# Altium project placa_adquisicion_ecg.PrjPcb
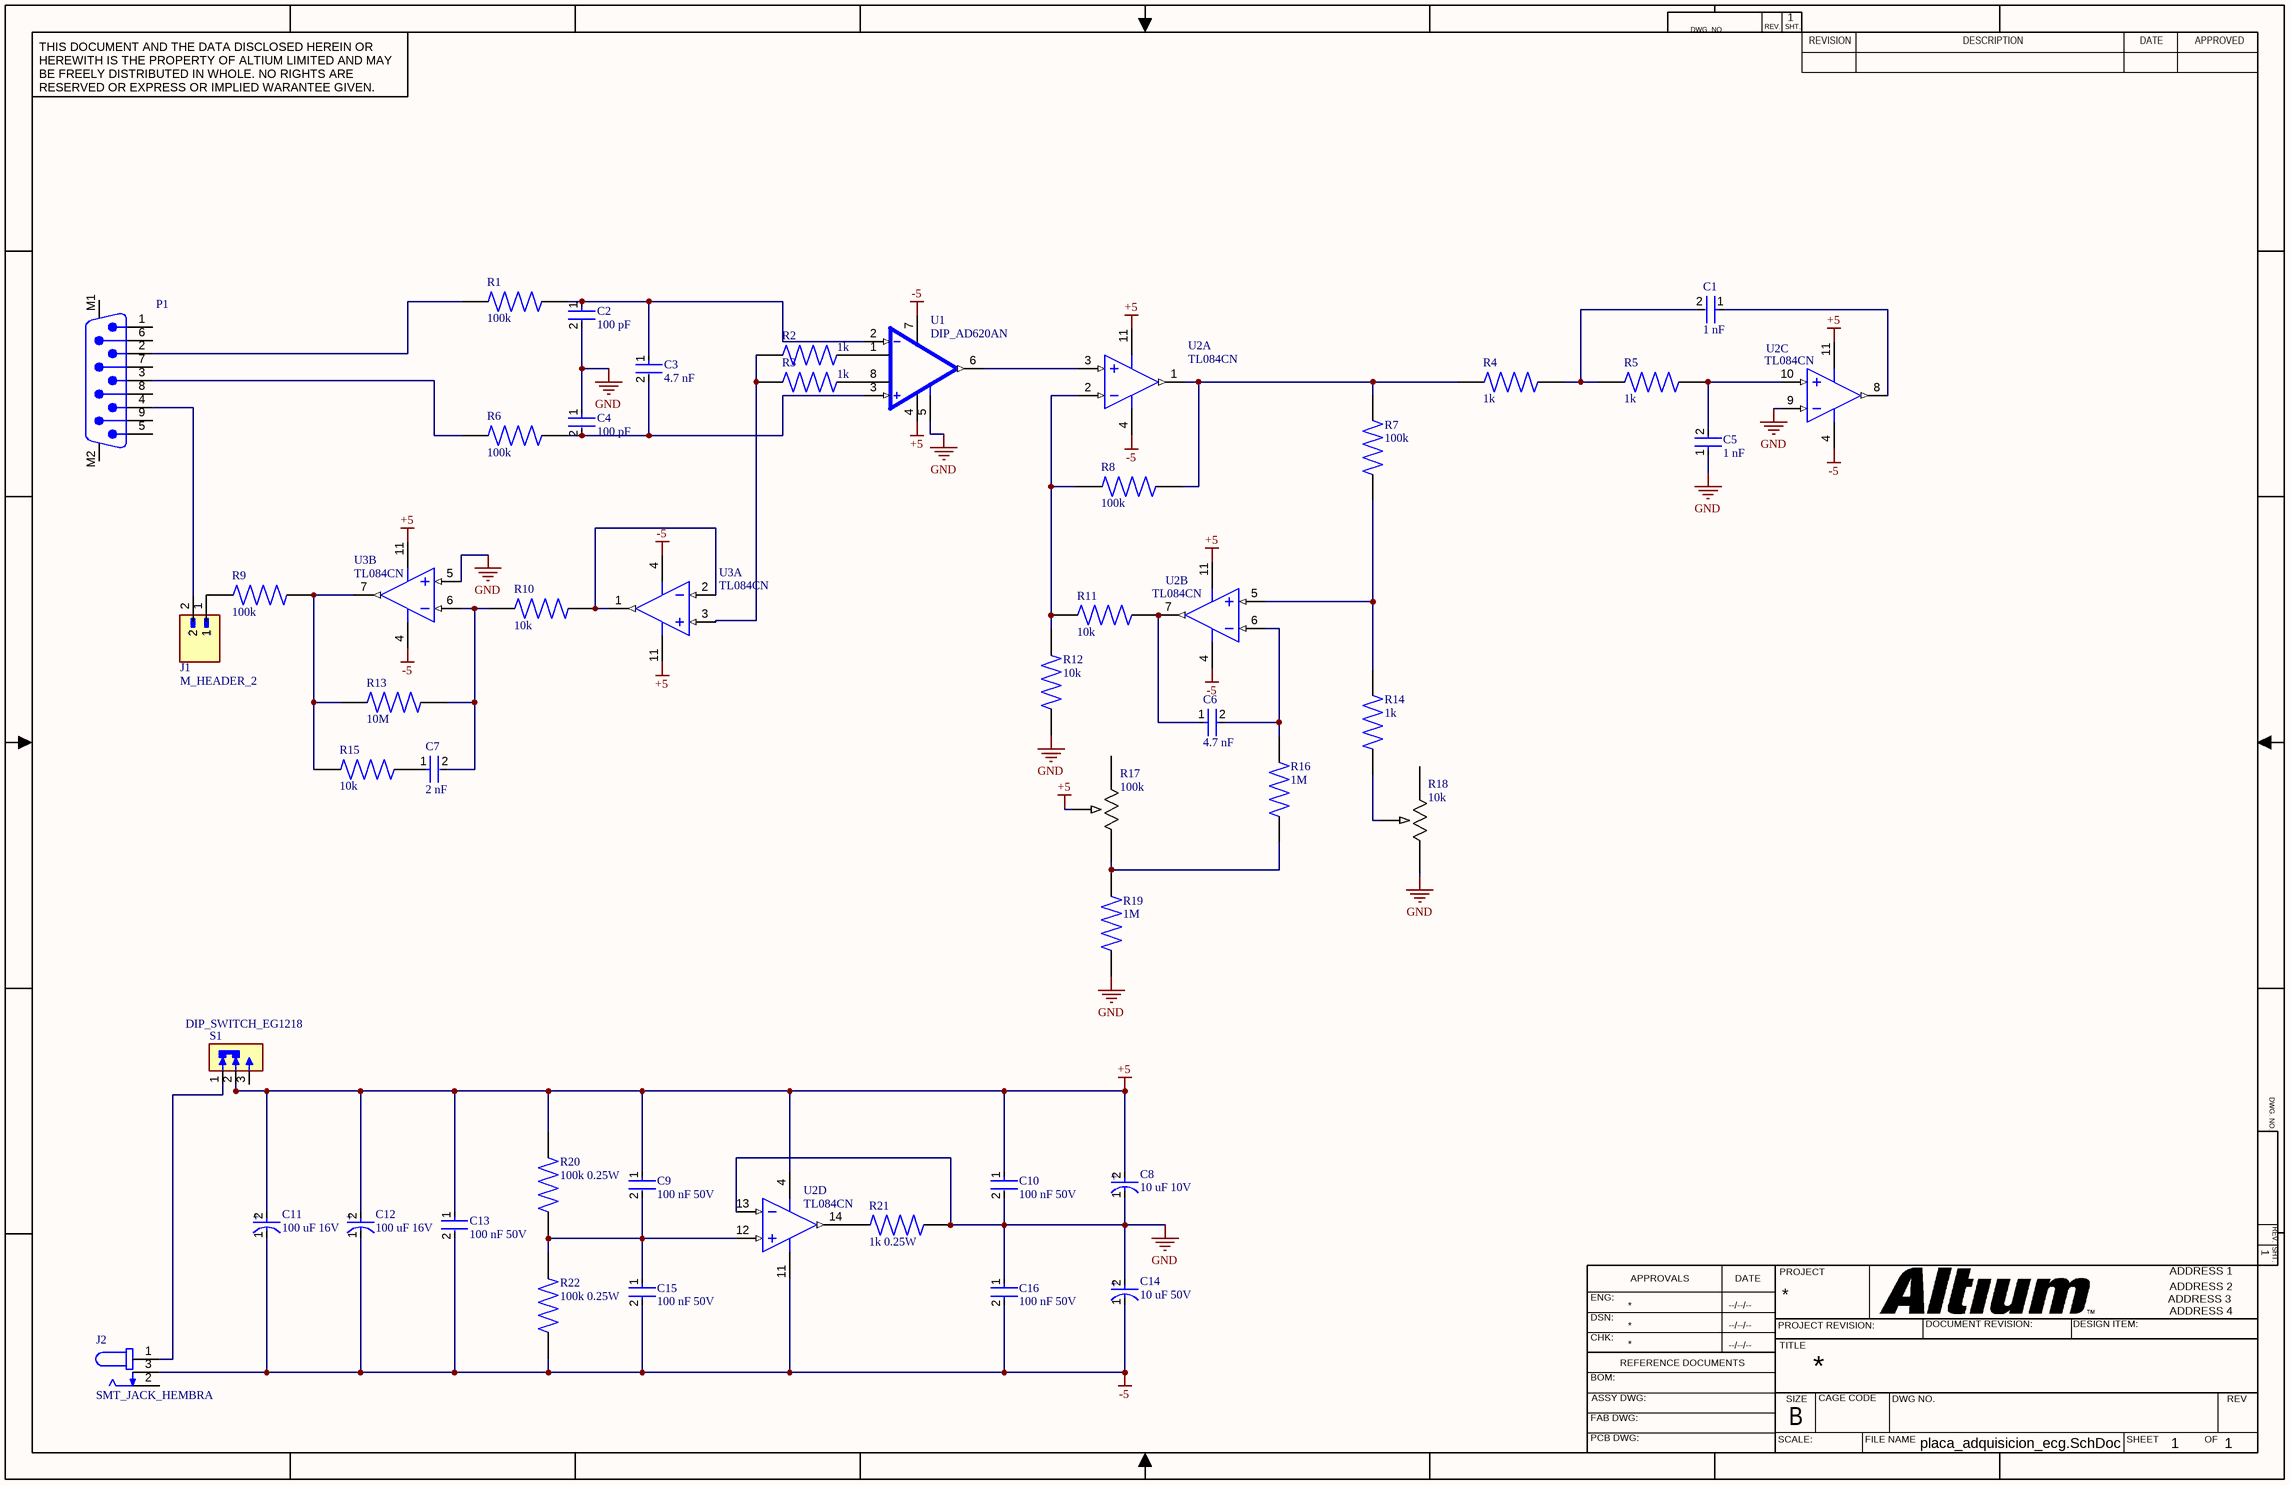
[diagram p0: placa_adquisicion_ecg.SchDoc]
1 sheet, 45 parts. Net scope: global (net labels, ports and power ports of the same name join across sheets).
Board file: placa_adquisicion_ecg.PcbDoc

## Sheet placa_adquisicion_ecg.SchDoc
size 431 x 279 mm; Organization: ORGANIZATION; Address1: ADDRESS 1; Address2: ADDRESS 2; Address3: ADDRESS 3; Address4: ADDRESS 4; Revision: -; SheetNumber: 1; SheetTotal: 1; ENG_APP_DATE: --/--/--; DSN_APP_DATE: --/--/--; CHK_APP_DATE: --/--/--

### Parts
C1  1 nF  [C_1206_50V]
C2  100 pF  [C_1206_50V]
C3  4.7 nF  [C_1206_50V]
C4  100 pF  [C_1206_50V]
C5  1 nF  [C_1206_50V]
C6  4.7 nF  [C_1206_50V]
C7  2 nF  [C_1206_50V]
C8  10 uF 10V  [C_DIP_100uF_16V]
C9  100 nF 50V  [C_1206_50V]
C10  100 nF 50V  [C_1206_50V]
C11  100 uF 16V  [C_DIP_100uF_16V]
C12  100 uF 16V  [C_DIP_100uF_16V]
C13  100 nF 50V  [C_1206_50V]
C14  10 uF 50V  [C_DIP_100uF_16V]
C15  100 nF 50V  [C_1206_50V]
C16  100 nF 50V  [C_1206_50V]
J1  M_HEADER_2  [M_HEADER_2]
J2  SMT_JACK_HEMBRA  [SMT_JACK_HEMBRA]
P1  618009231221  [DIP_DB9M_90DEG]  (value not drawn)
R1  100k  [R_1206_0.25W]
R2  1k  [R_1206_0.25W]
R3  1k  [R_1206_0.25W]
R4  1k  [R_1206_0.25W]
R5  1k  [R_1206_0.25W]
R6  100k  [R_1206_0.25W]
R7  100k  [R_1206_0.25W]
R8  100k  [R_1206_0.25W]
R9  100k  [R_1206_0.25W]
R10  10k  [R_1206_0.25W]
R11  10k  [R_1206_0.25W]
R12  10k  [R_1206_0.25W]
R13  10M  [R_1206_0.25W]
R14  1k  [R_1206_0.25W]
R15  10k  [R_1206_0.25W]
R16  1M  [R_1206_0.25W]
R17  100k  [POT_TRIMMER]
R18  10k  [POT_TRIMMER]
R19  1M  [R_1206_0.25W]
R20  100k 0.25W  [R_1206_0.25W]
R21  1k 0.25W  [R_1206_0.25W]
R22  100k 0.25W  [R_1206_0.25W]
S1  DIP_SWITCH_EG1218  [DIP_SWITCH_EG128]
U1  DIP_AD620AN  [DIP_AD620AN]
U2  TL084CN  [DIP_TL084CN]  (parts A,B,C,D of 4)
U3  TL084CN  [DIP_TL084CN]  (parts A,B of 4)

### Nets
+5: C8.2(A) C9.1 C10.1 C11.2(A) C12.2(A) C13.1 R17.2 R20.2 S1.2(COM) U1.4(-VS) U2.4(VCC+) U2.11(VCC-) U3.11(VCC-)
-5: C11.1(C) C12.1(C) C13.2 C14.1(C) C15.2 C16.2 J2.3 R22.1 U1.7(+VS) U2.4(VCC+) U2.11(VCC-) U3.4(VCC+)
GND: C2.2 C4.1 C5.1 C8.1(C) C10.2 C14.2(A) C16.1 R12.1 R18.1 R19.1 R21.2 U1.5(REF) U2.9(IN3-) U2.13(IN4-) U3.5(IN2+)
NetC1_1: C1.1 U2.8(OUT3)
NetC1_2: C1.2 R4.2 R5.1
NetC2_1: C2.1 C3.1 R1.2 U1.2(-IN)
NetC3_2: C3.2 C4.2 R6.2 U1.3(+IN)
NetC5_2: C5.2 R5.2 U2.10(IN3+)
NetC6_1: C6.1 R11.2 U2.7(OUT2)
NetC6_2: C6.2 R16.2 U2.6(IN2-)
NetC7_1: C7.1 R15.2
NetC7_2: C7.2 R10.1 R13.2 U3.6(IN2-)
NetC9_2: C9.2 C15.1 R20.1 R22.2 U2.12(IN4+)
NetJ1_1: J1.1 R9.1
NetJ1_2: J1.2 P1.4
NetJ2_1: J2.1 S1.1(NC)
NetP1_2: P1.2 R1.1
NetP1_3: P1.3 R6.1
NetR2_1: R2.1 R3.1 U3.3(IN1+)
NetR2_2: R2.2 U1.1(RG_1)
NetR3_2: R3.2 U1.8(RG_8)
NetR4_1: R4.1 R7.2 R8.2 U2.1(OUT1)
NetR7_1: R7.1 R14.2 U2.5(IN2+)
NetR8_1: R8.1 R11.1 R12.2 U2.2(IN1-)
NetR9_2: R9.2 R13.1 R15.1 U3.7(OUT2)
NetR10_2: R10.2 U3.1(OUT1) U3.2(IN1-)
NetR14_1: R14.1 R18.2
NetR16_1: R16.1 R17.1 R19.2
NetR21_1: R21.1 U2.14(OUT4)
NetU1_6: U1.6(OUTPUT) U2.3(IN1+)

Not connected (* = marked no-connect by the designer): J2 2; P1 1 5 6 7 8 9 M1 M2; R17 3; R18 3; S1 3(NO)

### Notes on the sheet
- DWG. NO.
- REV.
- SHT.
- THIS DOCUMENT AND THE DATA DISCLOSED HEREIN OR HEREWITH IS THE PROPERTY OF ALTIUM LIMITED AND MAY BE FREELY DISTRIBUTED IN WHOLE. NO RIGHTS ARE RESERVED OR EXPRESS OR IMPLIED WARANTEE GIVEN.
- REVISION
- DESCRIPTION
- DATE
- APPROVED
- ENG:
- APPROVALS
- PROJECT
- DSN:
- CHK:
- REFERENCE DOCUMENTS
- PROJECT REVISION:
- TITLE
- DOCUMENT REVISION:
- DESIGN ITEM:
- BOM:
- FAB DWG:
- PCB DWG:
- ASSY DWG:
- SCALE:
- SIZE
- B
- CAGE CODE
- FILE NAME
- DWG NO.
- SHEET
- OF
- REV
- (in symbol C_DIP_100uF_16V) +

### Library data of the parts
C1 C3 C5-C7 = C_1206_50V: Multilayer Ceramic Capacitor, C Series, 100 Pf, - 5%, C0g / Np0, 50 V, 1206 [3216 Metric]; Manufacturer Part Number: C1206C101J5GACTU; Manufacturer: KEMET; Capacitance: 100 pF; Automotive Grade: Grade 0; Temperature Coefficient: 15%; Tolerance: 0.05; Voltage Rating: 50 V; Value: 100 pF; Octopart: https://octopart.com/c1206c101j5gactu-kemet-102340; Category: Cap; Device Class L2: Capacitors; Temperature: -55°C to +150°C; Material: Ceramic; ComponentLink2Description: Datasheet; Temperature Range High: +150°C; ComponentLink2URL: https://content.kemet.com/datasheets/KEM_C1007_X8R_ULTRA_150C_SMD.pdf; Ipc Land Pattern Name: CAPC320160X78; Device Class L3: Ceramic Capacitors; Package: C1206C-EB; Lead Free: Yes; Height: 0.88mm; Digikey Description: Multilayer Ceramic Capacitor, C Series, 100 Pf, - 5%, C0g / Np0, 50 V, 1206 [3216 Metric]; Device Class L1: Passive Components; Automotive: Yes; RoHS: TRUE; Temperature Range Low: -55°C; Temperature Characteristic: C0G; Mouser Description: Multilayer Ceramic Capacitors MLCC - SMD/SMT 50volts 100pF C0G 5%
C2 C4 = C_1206_50V: Multilayer Ceramic Capacitor, C Series, 100 Pf, - 5%, C0g / Np0, 50 V, 1206 [3216 Metric]; Manufacturer Part Number: C1206C101J5GACTU; Manufacturer: KEMET; Automotive Grade: Grade 0; Temperature Coefficient: 15%; Tolerance: 0.05; Voltage Rating: 50 V; Capacitance: 100 pF; Octopart: https://octopart.com/c1206c101j5gactu-kemet-102340; Category: Cap; Device Class L2: Capacitors; Temperature: -55°C to +150°C; Material: Ceramic; ComponentLink2Description: Datasheet; Temperature Range High: +150°C; ComponentLink2URL: https://content.kemet.com/datasheets/KEM_C1007_X8R_ULTRA_150C_SMD.pdf; Ipc Land Pattern Name: CAPC320160X78; Device Class L3: Ceramic Capacitors; Package: C1206C-EB; Lead Free: Yes; Height: 0.88mm; Digikey Description: Multilayer Ceramic Capacitor, C Series, 100 Pf, - 5%, C0g / Np0, 50 V, 1206 [3216 Metric]; Device Class L1: Passive Components; Automotive: Yes; RoHS: TRUE; Temperature Range Low: -55°C; Temperature Characteristic: C0G; Mouser Description: Multilayer Ceramic Capacitors MLCC - SMD/SMT 50volts 100pF C0G 5%; Value: 100 pF
C8 C11 C12 C14 = C_DIP_100uF_16V: Aluminum Electrolytic Capacitors (Radial Lead Type) AEC-Q200 Qualified 100uF ±20% 16V; Lead/Base Style: Straight; Life (Hours): 1000Hour; Polarity: Polar; Ripple Current: 110mA; Lead Diameter: 0.5mm; Packaging: Bulk; Tolerance: 20%; Package Quantity: 200; Lead Pitch: 2.5mm; RoHS Compliant: Yes; Length: 11mm; Capacitance: 100uF; Max Operating Temperature: 105°C; REACH SVHC: No SVHC; Termination: Radial; Lead Free: Lead Free; Number of Pins: 2; Ripple Current (AC): 110mA; Mount: Through Hole; Diameter: 5mm; Min Operating Temperature: -55°C; Construction: RADIAL; Voltage Rating: 16V; Voltage Rating (DC): 16V; Case/Package: Radial; Height: 11mm; Height - Seated (Max): 0.492inch; Voltage: 16V; Series: HD
C9 C10 C13 C15 C16 = C_1206_50V: Multilayer Ceramic Capacitor, C Series, 100 Pf, - 5%, C0g / Np0, 50 V, 1206 [3216 Metric]; Manufacturer Part Number: C1206C101J5GACTU; Manufacturer: KEMET; Capacitance: 100 pF; Automotive Grade: Grade 0; Temperature Coefficient: 15%; Tolerance: 0.05; Value: 100 pF; Octopart: https://octopart.com/c1206c101j5gactu-kemet-102340; Category: Cap; Device Class L2: Capacitors; Temperature: -55°C to +150°C; Material: Ceramic; ComponentLink2Description: Datasheet; Temperature Range High: +150°C; ComponentLink2URL: https://content.kemet.com/datasheets/KEM_C1007_X8R_ULTRA_150C_SMD.pdf; Ipc Land Pattern Name: CAPC320160X78; Device Class L3: Ceramic Capacitors; Package: C1206C-EB; Lead Free: Yes; Height: 0.88mm; Digikey Description: Multilayer Ceramic Capacitor, C Series, 100 Pf, - 5%, C0g / Np0, 50 V, 1206 [3216 Metric]; Device Class L1: Passive Components; Automotive: Yes; RoHS: TRUE; Temperature Range Low: -55°C; Temperature Characteristic: C0G; Voltage Rating: 50 V; Mouser Description: Multilayer Ceramic Capacitors MLCC - SMD/SMT 50volts 100pF C0G 5%
J1 = M_HEADER_2: 2.54mm (0.1) Pitch SIL Vertical Throughboard Pin Header, 6.1mm mating pin height, tin, 2 contacts; MF: Harwin; MP: M20-9990246; SnapEDA_Link: https://www.snapeda.com/parts/M20-9990246/Harwin/view-part/?ref=snap; Package: None; Value: *; Check_prices: https://www.snapeda.com/parts/M20-9990246/Harwin/view-part/?ref=eda
J2 = SMT_JACK_HEMBRA: 2.0 x 6.3 mm, 5.0 A, Horizontal, Surface Mount (SMT), Dc Power Jack Connector; MF: Same Sky; MP: PJ-036AH-SMT-TR; SnapEDA_Link: https://www.snapeda.com/parts/PJ-036AH-SMT-TR/Same+Sky/view-part/?ref=snap; Package: None; Value: *; Check_prices: https://www.snapeda.com/parts/PJ-036AH-SMT-TR/Same+Sky/view-part/?ref=eda
P1 = DIP_DB9M_90DEG: NexarPartId: 22865742; Pitch: 2.77mm; Number of Contacts: 9; Operating Supply Voltage: 125V; Insulation Resistance: 5GΩ; Gender: Male; Contact Resistance: 30mΩ; Current Rating: 3A; Mount: Through Hole; Housing Material: Steel; Contact Plating: Gold; Width: 12.5mm; Insulation Material: PBT; RoHS: Compliant; Depth: 18.5mm; Contact Material: Gold; Max Operating Temperature: 105°C; Min Operating Temperature: -55°C; Termination: SMD/SMT; Height: 12.7mm; Voltage Rating: 125V; Length: 30.8mm; Orientation: Right Angle; Number of Rows: 2; Number of Pins: 9; REACH SVHC: Unknown
R1-R16 R19-R22 = R_1206_0.25W: 10 kOhms Â±1% 0.25W, 1/4W Chip Resistor 1206 (3216 Metric) Moisture Resistant Thick Film; MF: Yageo; MP: RC1206FR-0710KL; Package: 3116 Yageo; Price: None; Check_prices: https://www.snapeda.com/parts/RC1206FR-0710KL/Yageo/view-part/?ref=eda; Value: *; SnapEDA_Link: https://www.snapeda.com/parts/RC1206FR-0710KL/Yageo/view-part/?ref=snap; Availability: In Stock; Purchase-URL: https://pricing.snapeda.com/search?q=RC1206FR-0710KL&ref=eda
R17 R18 = POT_TRIMMER: Description; Manufacturer_Name: Bourns Electronics; Manufacturer_Part_Number: PV36W104C01B00; Type: Trimmer Potentiometers; Copyright: Copyright (C) 2025 Ultra Librarian. All rights reserved.
S1 = DIP_SWITCH_EG128: Slide Switch, EG Series, SPDT, Non-Shorting, ON-ON, 200mA DC, 30VDC, PC Pin | E-Switch EG1218; SnapEDA_Link: https://www.snapeda.com/parts/EG1218/E-Switch/view-part/?ref=snap; Package: None; Value: *; MF: E-Switch; MP: EG1218; Check_prices: https://www.snapeda.com/parts/EG1218/E-Switch/view-part/?ref=eda
U1 = DIP_AD620AN: Instrumentation Amplifier 1 Circuit - 8-PDIP; MF: Analog Devices; Value: *; Purchase-URL: https://pricing.snapeda.com/search/part/AD620AN/?ref=eda; Check_prices: https://www.snapeda.com/parts/AD620AN/Analog+Devices+Inc./view-part/?ref=eda; Price: None; MP: AD620AN; SnapEDA_Link: https://www.snapeda.com/parts/AD620AN/Analog+Devices+Inc./view-part/?ref=snap; Availability: In Stock; Package: PDIP-8 Linear Technology
U2 U3 = DIP_TL084CN: JFET-Input Operational Amplifier, 7 to 36 V, 0 to 70 degC, 14-pin DIP (N14), Pb-Free (RoHS); Manufacturer: Texas Instruments; Rating: Catalog; Iq per channel(Max)(mA): 2.8; Number of Channels: 4; IIB(Max)(pA): 400; Vio (25C)(Max)(mV): 15; GBW(Typ)(MHz): 3; Total Supply Voltage(Max)(+5V is 5, +/-5V is 10): 36; Vn at 1kHz(Typ)(nV/rtHz): 18; Sub Family: General Purpose Amplifier, High Supply Voltage Amplifier (>=30V); Slew Rate(Typ)(V/us): 13; Total Supply Voltage(Min)(+5V is 5, +/-5V is 10): 7; CMRR(Min)(dB): 70; ComponentLink3Description: Package Specification; PackageDescription: 14-Pin Plastic In-Line, Body 19.305 x 6.35 mm, Pitch 2.54 mm; ComponentLink1Description: Manufacturer URL; PackageVersion: 4040049/E, 12/2002; Eco-Plan: Pb-Free (RoHS); ComponentLink2URL: http://www.ti.com/lit/ds/symlink/tl084.pdf; ComponentLink1URL: http://www.ti.com/; DatasheetVersion: SLOS081G; Mounting Technology: Through Hole; PartNumber: TL084CN; Offset Drift(Typ)(uV/C): 18; PackageReference: N0014A; ComponentLink3URL: http://www.ti.com/lit/ml/mpdi002c/mpdi002c.pdf; ComponentLink2Description: Datasheet; Code_JEDEC: MS-001